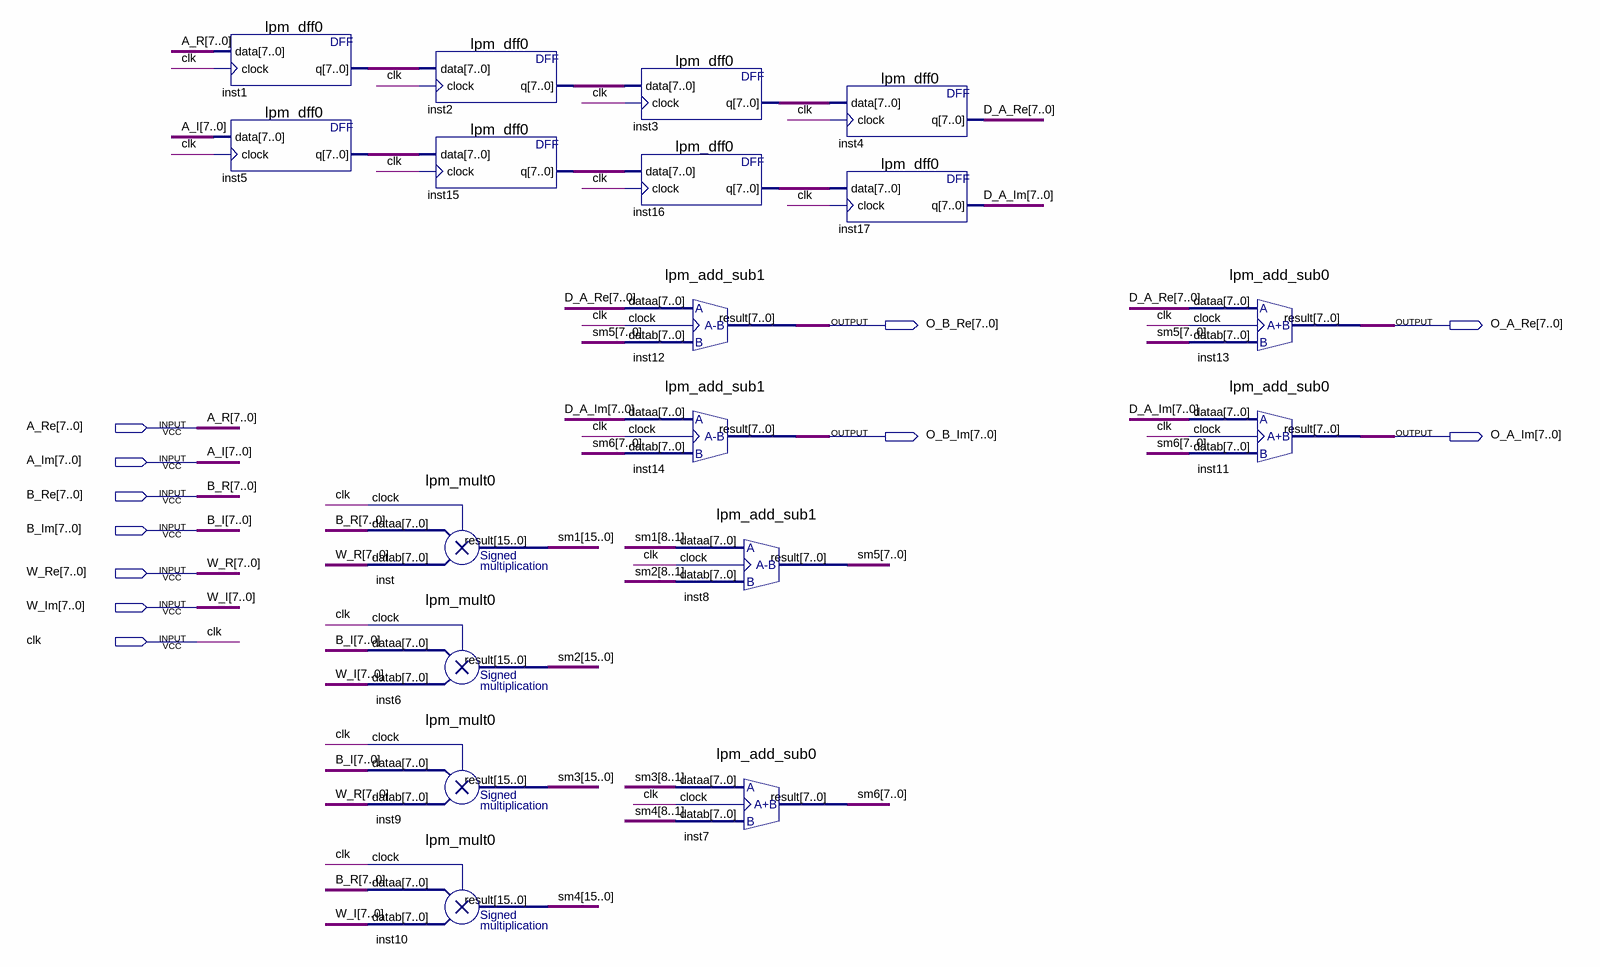
[diagram p0: schematic sheet]
// Quartus schematic babl.bdf as structural Verilog: 18 symbols, 11 pins
module babl (
  input  [7:0] A_Re,
  input  [7:0] A_Im,
  input  [7:0] B_Re,
  input  [7:0] B_Im,
  input  [7:0] W_Re,
  input  [7:0] W_Im,
  input  clk,
  output [7:0] O_B_Re,
  output [7:0] O_A_Re,
  output [7:0] O_B_Im,
  output [7:0] O_A_Im
);

  wire [7:0] D_A_Im, D_A_Re, inst1_q, inst2_q, inst3_q, inst5_q, inst15_q, inst16_q, sm5, sm6;
  wire [15:0] sm1, sm2, sm3, sm4;

  lpm_dff0 inst1 (.data(A_Re), .clock(clk), .q(inst1_q));
  lpm_dff0 inst5 (.data(A_Im), .clock(clk), .q(inst5_q));
  lpm_dff0 inst2 (.data(inst1_q), .clock(clk), .q(inst2_q));
  lpm_dff0 inst15 (.data(inst5_q), .clock(clk), .q(inst15_q));
  lpm_mult0 inst (.dataa(B_Re), .datab(W_Re), .clock(clk), .result(sm1));
  lpm_mult0 inst6 (.dataa(B_Im), .datab(W_Im), .clock(clk), .result(sm2));
  lpm_mult0 inst9 (.dataa(B_Im), .datab(W_Re), .clock(clk), .result(sm3));
  lpm_mult0 inst10 (.dataa(B_Re), .datab(W_Im), .clock(clk), .result(sm4));
  lpm_dff0 inst3 (.data(inst2_q), .clock(clk), .q(inst3_q));
  lpm_dff0 inst16 (.data(inst15_q), .clock(clk), .q(inst16_q));
  lpm_add_sub1 inst12 (.dataa(D_A_Re), .datab(sm5), .clock(clk), .result(O_B_Re));
  lpm_add_sub1 inst14 (.dataa(D_A_Im), .datab(sm6), .clock(clk), .result(O_B_Im));
  lpm_add_sub1 inst8 (.dataa(sm1[8:1]), .datab(sm2[8:1]), .clock(clk), .result(sm5));
  lpm_add_sub0 inst7 (.dataa(sm3[8:1]), .datab(sm4[8:1]), .clock(clk), .result(sm6));
  lpm_dff0 inst4 (.data(inst3_q), .clock(clk), .q(D_A_Re));
  lpm_dff0 inst17 (.data(inst16_q), .clock(clk), .q(D_A_Im));
  lpm_add_sub0 inst13 (.dataa(D_A_Re), .datab(sm5), .clock(clk), .result(O_A_Re));
  lpm_add_sub0 inst11 (.dataa(D_A_Im), .datab(sm6), .clock(clk), .result(O_A_Im));

  // Other names for the same wires on the sheet: A_I[7:0] = A_Im; A_R[7:0] = A_Re; B_I[7:0] = B_Im; B_R[7:0] = B_Re;
  //   W_I[7:0] = W_Im; W_R[7:0] = W_Re
endmodule
